# Altium schematic sheet Sheet3.SchDoc
size A; SheetNumber: 1; SheetTotal: 1
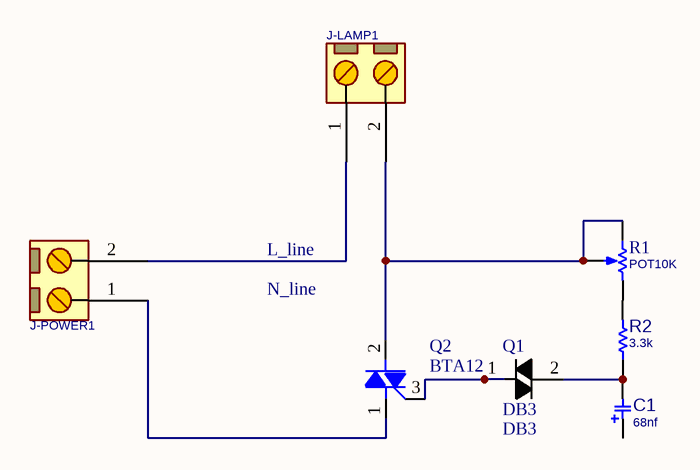
[diagram p0: Sheet3.SchDoc]

## Parts
C1  68nf  [C_FLM_7X5H11]
J-LAMP1  CONN_TB2  [MSTB_2]  (value not drawn)
J-POWER1  CONN_TB2  [MSTB_2]  (value not drawn)
Q1  DB3  [D_AX03_DO35]
Q2  BTA12  [TO220_3]
R1  POT10K  [VOL_R]
R2  3.3k  [R025W_AX04]

## Nets
NetC1_2: C1.2 Q1.2(A2) R2.1
NetJ-LAMP1_1: J-LAMP1.1 J-POWER1.2
NetJ-LAMP1_2: J-LAMP1.2 Q2.2(T2) R1.1(TOP) R1.2(TAP)
NetJ-POWER1_1: J-POWER1.1 Q2.1(T1)
NetQ1_1: Q1.1(A1) Q2.3(G)
NetR1_3: R1.3(BOT) R2.2

Not connected (* = marked no-connect by the designer): C1 1

## Notes on the sheet
- L_line
- N_line

## Library data of the parts
C1 = CAP_THD_FLM: CAP, THD, FILM,; MANF_P#: MANF_PART#; PARAM2: 25V; DESC: DESCRIPTION; DIST#: MOUSER; PARAM: 20%; PRICE: 10= 5$; MANF: MANF; ASSEMBLY: ASSEMBLY; VALUE: 68nf
J-LAMP1 J-POWER1 = CONN_MSTB_2: CONN, PHOENIX MSTB, 5-G, 5.08mm pitch; PARAM2: 320V; PARAM: 12A; VALUE: CONN_TB2
Q1 = DIAC_DB3_DO35: Diac, 32VBO, DO-35; MANF: ST; PARAM: 2A, -40~125oC; MANF_P#: DB3; PRICE: toman@PAYA; PARAM2: 32VBO; VALUE: DB3
Q2 = TRIAC_BTA12-600_TO220: Triac, 600V, 12A, TO-220; MANF_P#: BTA12-600BW, BTA12-600CW, BTA12-600TW; MANF: ST; PRICE: 1200toman@PAYA; VALUE: BTA12
R1 = RES_THD_POT_VOL: RESISTOR, THD, Potentiometer Volume; VALUE: POT10K
R2 = RES_THD: RESISTOR, THD; MANF_P#: RK73H1ETTP4701F; MANF: KOA SPEER; PARAM: 0.063W; DESC: DESCRIPTION; DIST#: MOUSER; PARAM2: 1%; ASSEMBLY: ASSEMBLY; PRICE: 100= 0.5$; VALUE: 3.3k